# EAGLE design DragonShield (EAGLE 6.2)
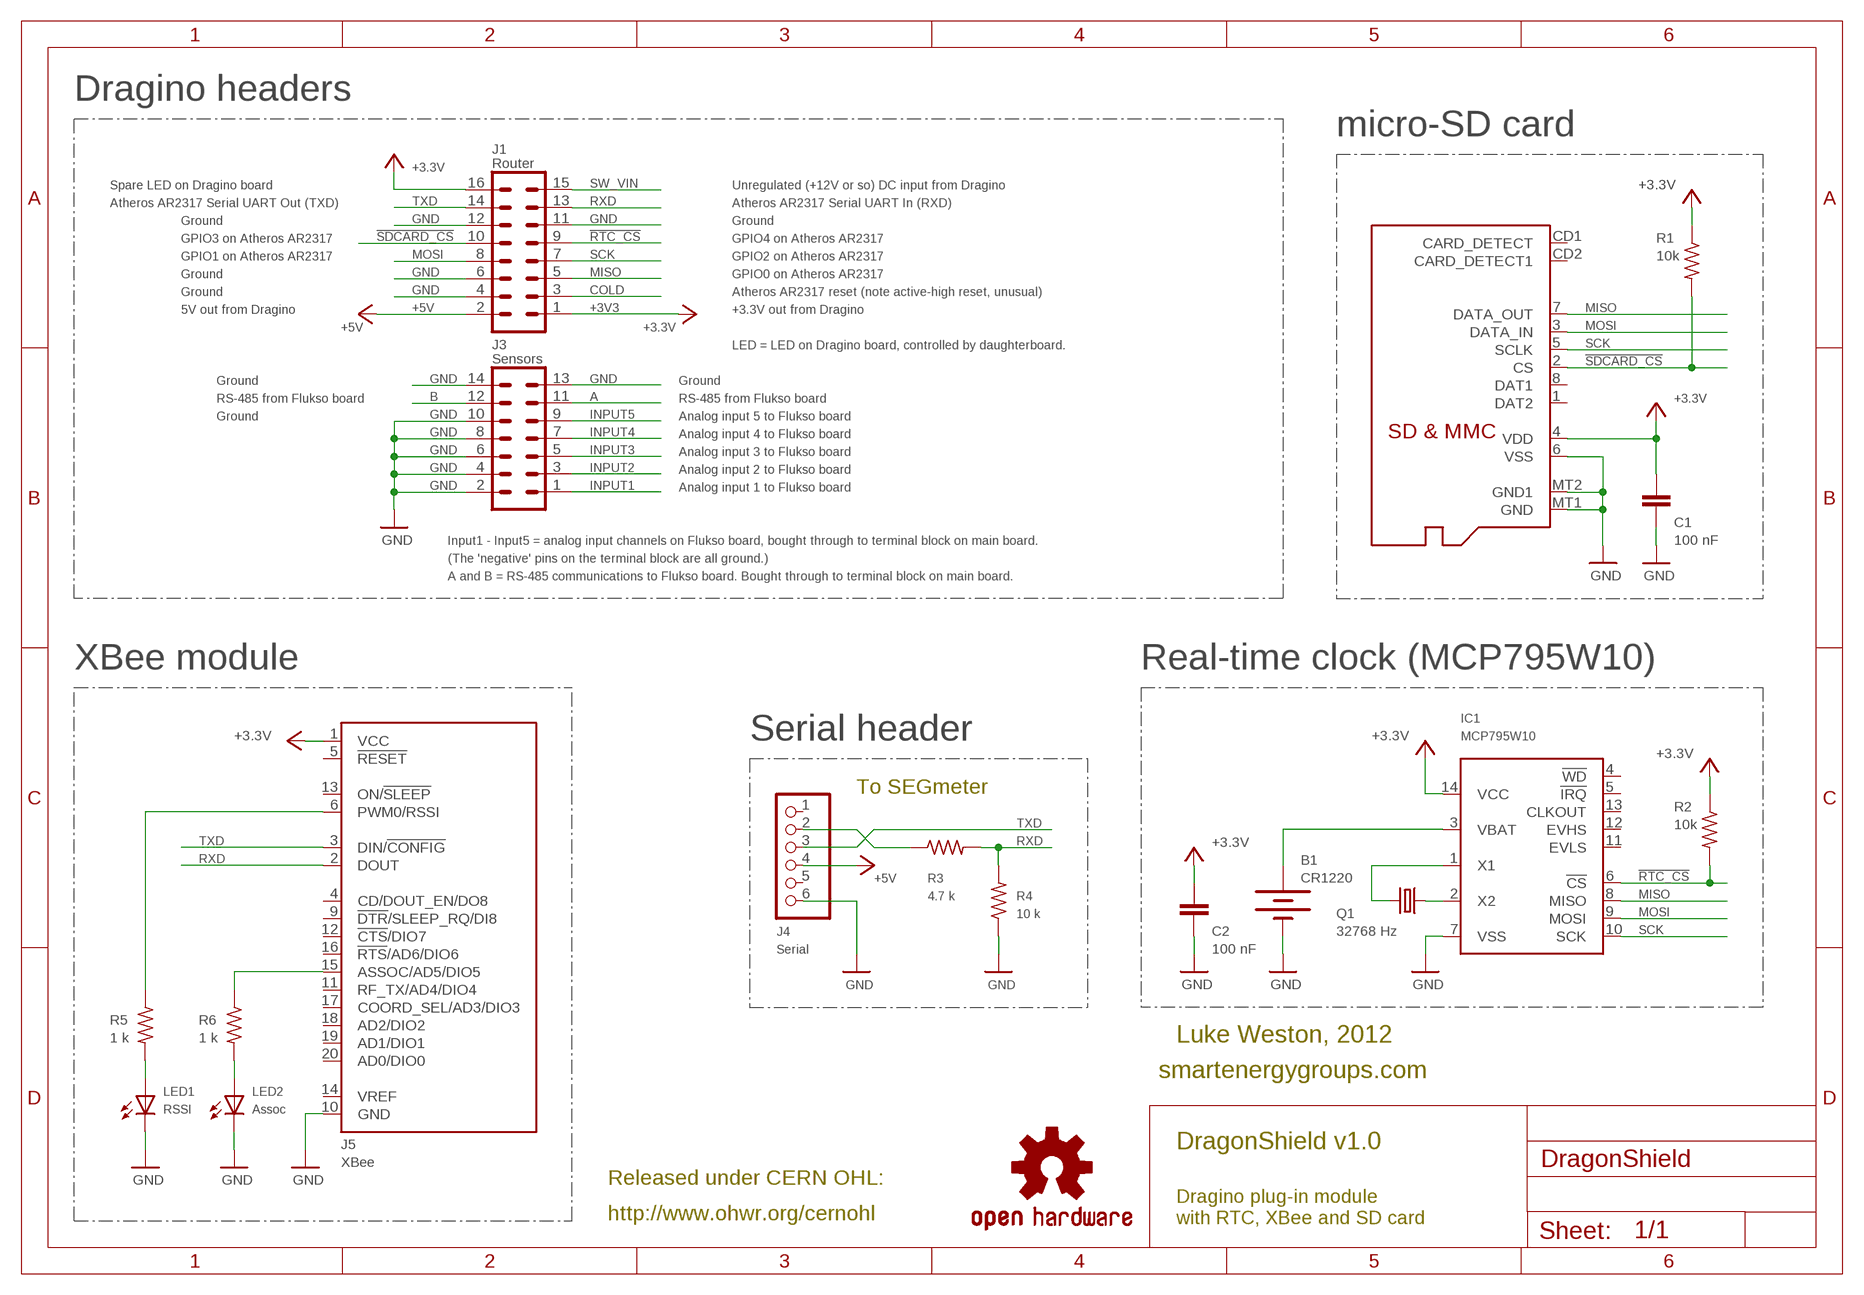
[diagram p0: schematic, sheet 1]

## Parts
B1  CR1220  BATTERY12MM  [BATTCON_12MM]
C1  100 nF  C-EUC0805K  [C0805K]
C2  100 nF  C-EUC0805K  [C0805K]
IC1  MCP795W10  MCP795W10SO  [SOIC14]
J1  Router  MA08-2  [MA08-2]
J2  MICROSD  [MICROSD]
J3  Sensors  MA07-2  [MA07-2]
J4  Serial  PINHD-1X6  [1X06]
J5  XBee  XBEE-PRO  [XBEE-PRO]
LED1  RSSI  LED0805-LARGE  [LED-0805-LARGE]
LED2  Assoc  LED0805-LARGE  [LED-0805-LARGE]
Q1  32768 Hz  CRYSTALTC26H  [TC26H]
R1  10k  R-US_M0805  [M0805]
R2  10k  R-US_M0805  [M0805]
R3  4.7 k  R-US_M0805  [M0805]
R4  10 k  R-US_M0805  [M0805]
R5  1 k  R-US_M0805  [M0805]
R6  1 k  R-US_M0805  [M0805]
U$  OSHW-LOGOS  [OSHW-LOGO-S]

## Nets
!RTC_CS: IC1.6(!CS) J1.9 R2.2
!SDCARD_CS: J1.10 J2.2(CS) R1.2
+3V3: C1.2 C2.2 IC1.14(VCC) J1.1 J1.16 J2.4(VDD) J5.1(VCC) R1.1 R2.1 ; supply symbol labelled +3.3V
+5V: J1.2 J4.4
A: J3.11
B: J3.12
COLD: J1.3
GND: B1.GND(-) C1.1 C2.1 IC1.7(VSS) J1.4 J1.6 J1.11 J1.12 J2.6(VSS) J2.MT1(GND) J2.MT2(GND1) J3.2 J3.4 J3.6 J3.8 J3.10 J3.13 J3.14 J4.6 J5.10(GND) LED1.C LED2.C R4.1
INPUT1: J3.1
INPUT2: J3.3
INPUT3: J3.5
INPUT4: J3.7
INPUT5: J3.9
MISO: IC1.8(MISO) J1.5 J2.7(DATA_OUT)
MOSI: IC1.9(MOSI) J1.8 J2.3(DATA_IN)
N$1: J4.2 R3.1
N$3: IC1.1(X1) Q1.2
N$4: IC1.2(X2) Q1.1
N$5: LED2.A R6.2
N$6: J5.15(ASSOC/AD5/DIO5) R6.1
N$7: LED1.A R5.2
N$8: J5.6(PWM0/RSSI) R5.1
N$11: B1.PWR@1(+) IC1.3(VBAT)
RXD: J1.13 J5.2(DOUT) R3.2 R4.2
SCK: IC1.10(SCK) J1.7 J2.5(SCLK)
SW_VIN: J1.15
TXD: J1.14 J4.3 J5.3(DIN/!CONFIG)
Unconnected: IC1.4(!WD) IC1.5(!IRQ) IC1.11(EVLS) IC1.12(EVHS) IC1.13(CLKOUT) J2.1(DAT2) J2.8(DAT1) J2.CD1(CARD_DETECT) J2.CD2(CARD_DETECT1) J4.1 J4.5 J5.4(CD/DOUT_EN/DO8) J5.5(!RESET) J5.9(!DTR!/SLEEP_RQ/DI8) J5.11(RF_TX/AD4/DIO4) J5.12(!CTS!/DIO7) J5.13(ON/!SLEEP) J5.14(VREF) J5.16(!RTS!/AD6/DIO6) J5.17(COORD_SEL/AD3/DIO3) J5.18(AD2/DIO2) J5.19(AD1/DIO1) J5.20(AD0/DIO0)

## Notes on the sheet
- Dragino headers
- micro-SD card
- Spare LED on Dragino board | Unregulated (+12V or so) DC input from Dragino
- Atheros AR2317 Serial UART Out (TXD) | Atheros AR2317 Serial UART In (RXD)
- Ground | Ground
- GPIO3 on Atheros AR2317 | GPIO4 on Atheros AR2317
- GPIO1 on Atheros AR2317 | GPIO2 on Atheros AR2317
- Ground | GPIO0 on Atheros AR2317
- Ground | Atheros AR2317 reset (note active-high reset, unusual)
- 5V out from Dragino | +3.3V out from Dragino
- LED = LED on Dragino board, controlled by daughterboard.
- Ground | Ground
- RS-485 from Flukso board | RS-485 from Flukso board
- Ground | Analog input 5 to Flukso board
- Analog input 4 to Flukso board
- Analog input 3 to Flukso board
- Analog input 2 to Flukso board
- Analog input 1 to Flukso board
- Input1 - Input5 = analog input channels on Flukso board, bought through to terminal block on main board.
- (The 'negative' pins on the terminal block are all ground.)
- A and B = RS-485 communications to Flukso board. Bought through to terminal block on main board.
- XBee module | Real-time clock (MCP795W10)
- Serial header
- To SEGmeter
- Luke Weston, 2012
- smartenergygroups.com
- DragonShield v1.0
- Released under CERN OHL:
- Dragino plug-in module
- http://www.ohwr.org/cernohl | with RTC, XBee and SD card

## Library data of the parts
B1 = SparkFun:BATTERY: Battery Holders Various common sizes : AA, AAA, 20mm coin cell and 12mm coin cell.
C1 C2 = resistor:C-EU: CAPACITOR, European symbol
IC1 = Luke:MCP795W10
J1 = con-lstb:MA08-2: PIN HEADER; OC_FARNELL: unknown; OC_NEWARK: unknown
J2 = adafruit:MICROSD: Micro-SD / Transflash card holder with SPI pinout For the 3M # 2908-05WB-MG and/or 4UCON #19656 push-push type
J3 = con-lstb:MA07-2: PIN HEADER; OC_FARNELL: unknown; OC_NEWARK: unknown
J4 = pinhead:PINHD-1X6: PIN HEADER
J5 = maxstream:XBEE: XBee (TM) /XBee-PRO(TM) OEM RF Modules Source: MaxStream, Inc. xbee_productmanual.pdf; MPN: XBP24-AWI-001; OC_FARNELL: 1337916; OC_NEWARK: 42M2667
LED1 LED2 = freetronics:LED: LEDs Standard schematic elements and footprints for 5mm, 3mm, 1206, and 0603 sized LEDs. 5mm - Spark Fun Electronics SKU : COM-00529 (and others)
Q1 = SparkFun:CRYSTAL: Crystals Various standard crystals. Proven footprints. Spark Fun Electronics SKU : COM-00534
R1-R6 = resistor:R-US_: RESISTOR, American symbol
U$ = SparkFun:OSHW-LOGO: Open Source Hardware Logo This logo indicates the piece of hardware it is found on incorporates a OSHW license and/or adheres to the definition of open source hardware found here: http://freedomdefined.org/OSHW

## Board
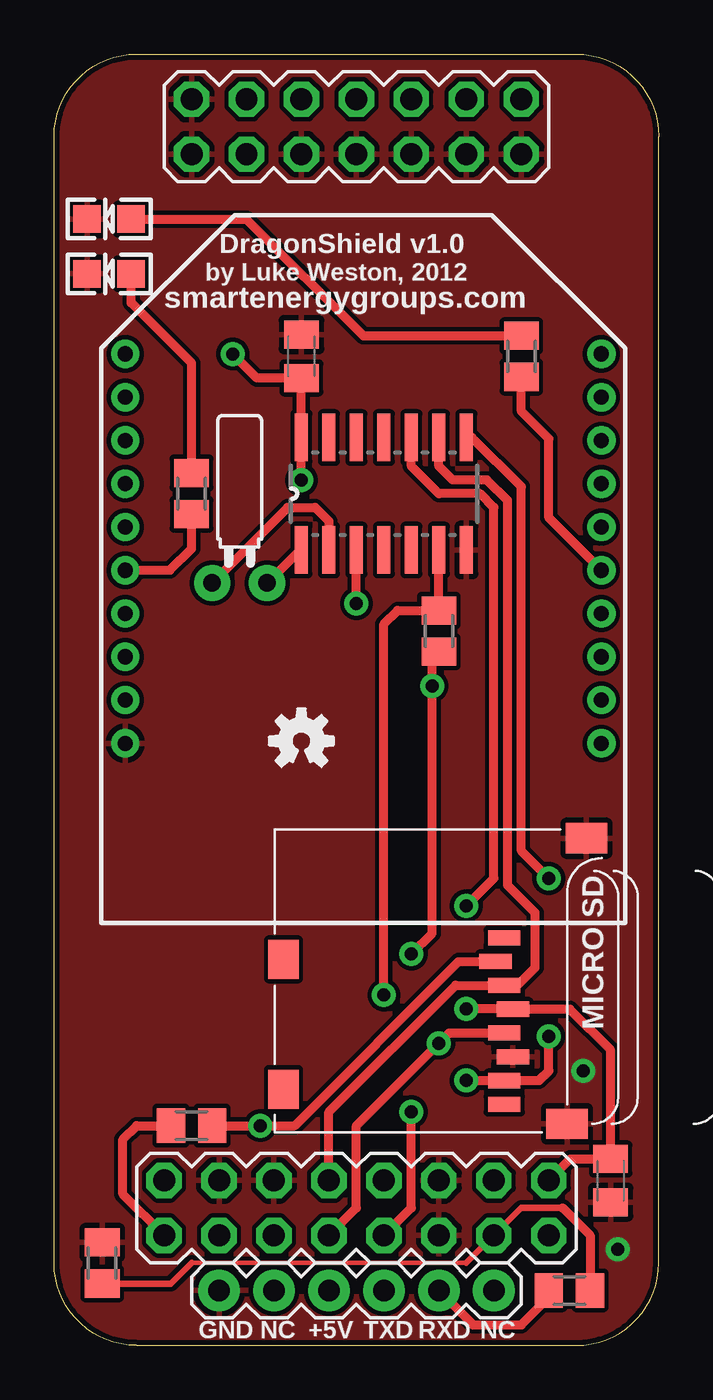
[diagram p1: board, top side]
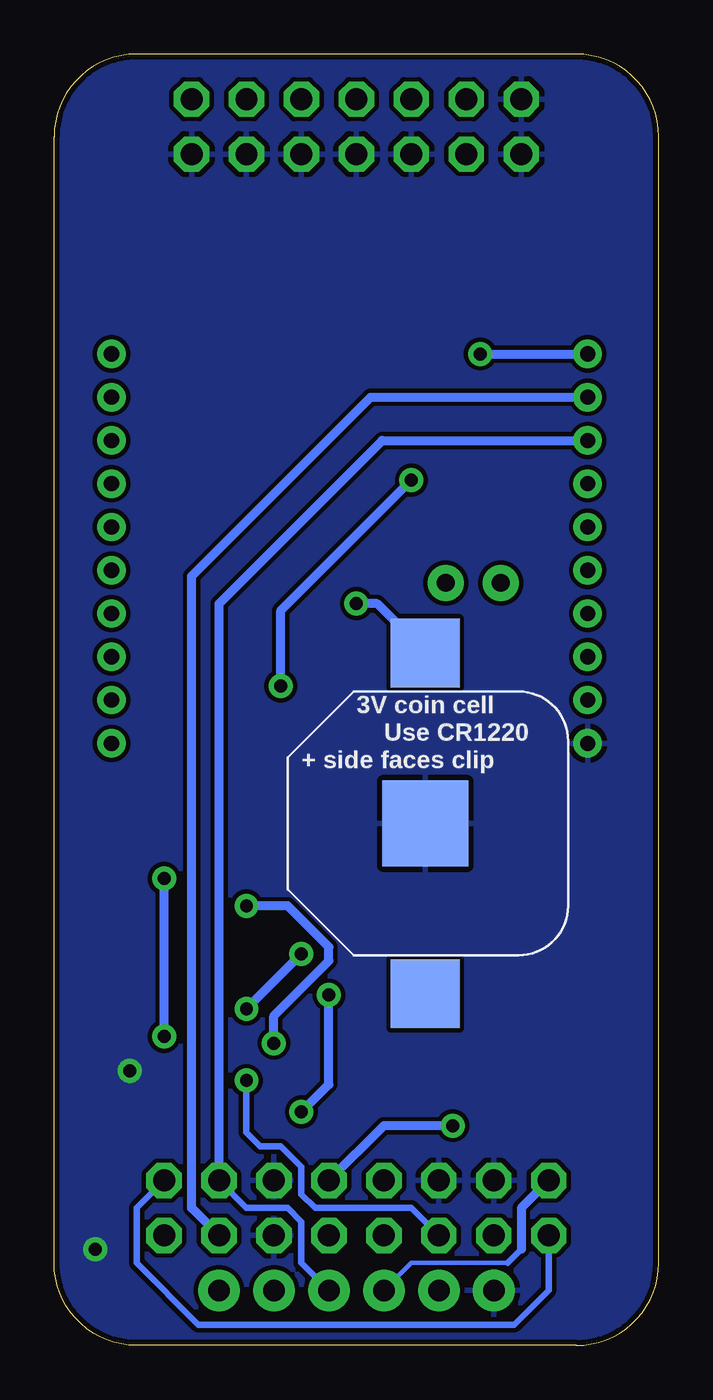
[diagram p2: board, bottom side, seen from below]

Size 27.94 x 59.69 mm. Coordinates in mm from the lower left corner, seen from the top.
Outline: 27.94,3.81 27.94,55.88 arc90 24.13,59.69 3.81,59.69 arc90 0,55.88 0,3.81 arc90 3.81,0 24.13,0 arc90 27.94,3.81
Copper layers (1*16): Top 0.035mm / dielectric 1.5mm / Bottom 0.035mm
Design rules: minimum track width 8mil, minimum drill 20mil, track to track 8mil, track to pad 8mil, pad to pad 8mil, via to via 8mil, smd to smd 8mil, copper to edge 10mil, drill to drill 8mil, minimum pad ring 12mil, minimum via ring 10mil, stop-mask expansion 4mil, vias tented up to drill 25mil, thermal gap 10mil

### Footprints (pad centres in the part's own frame; a part is rotated, then mirrored left to right if it is on the bottom)
BATTCON_12MM = smd 3.962 x 3.962: GND 0,0 | smd 3.175 x 3.175: PWR@1 -7.874,0; PWR@2 7.874,0
C0805K = smd 1.3 x 1.6: 1 -1,0; 2 1,0
SOIC14 = smd 0.6 x 2.2: 1 -3.81,-2.6; 2 -2.54,-2.6; 3 -1.27,-2.6; 4 0,-2.6; 5 1.27,-2.6; 6 2.54,-2.6; 7 3.81,-2.6; 8 3.81,2.6; 9 2.54,2.6; 10 1.27,2.6; 11 0,2.6; 12 -1.27,2.6; 13 -2.54,2.6; 14 -3.81,2.6
MA08-2 = drill 1.016 octagon: 1 -8.89,-1.27; 2 -8.89,1.27; 3 -6.35,-1.27; 4 -6.35,1.27; 5 -3.81,-1.27; 6 -3.81,1.27; 7 -1.27,-1.27; 8 -1.27,1.27; 9 1.27,-1.27; 10 1.27,1.27; 11 3.81,-1.27; 12 3.81,1.27; 13 6.35,-1.27; 14 6.35,1.27; 15 8.89,-1.27; 16 8.89,1.27
MICROSD = smd 0.7 x 1.5: 1 9,-10.64; 2 7.9,-10.24; 3 6.8,-10.64; 4 5.7,-11.04; 5 4.6,-10.64; 6 3.5,-11.04; 7 2.4,-10.64; 8 1.3,-10.64 | smd 1.8 x 1.4: CD1 2,-0.44; CD2 8,-0.44 | smd 1.4 x 1.9: MT1 0.4,-13.54; MT2 13.6,-14.44
MA07-2 = drill 1.016 octagon: 1 -7.62,-1.27; 2 -7.62,1.27; 3 -5.08,-1.27; 4 -5.08,1.27; 5 -2.54,-1.27; 6 -2.54,1.27; 7 0,-1.27; 8 0,1.27; 9 2.54,-1.27; 10 2.54,1.27; 11 5.08,-1.27; 12 5.08,1.27; 13 7.62,-1.27; 14 7.62,1.27
1X06 = drill 1 pad 1.93: 1 -6.35,0; 2 -3.81,0; 3 -1.27,0; 4 1.27,0; 5 3.81,0; 6 6.35,0
XBEE-PRO = drill 0.7 pad 1.27: 1 -11,9; 2 -11,7; 3 -11,5; 4 -11,3; 5 -11,1; 6 -11,-1; 7 -11,-3; 8 -11,-5; 9 -11,-7; 10 -11,-9; 11 11,-9; 12 11,-7; 13 11,-5; 14 11,-3; 15 11,-1; 16 11,1; 17 11,3; 18 11,5; 19 11,7; 20 11,9
LED-0805-LARGE = smd 1.27 x 1.27: A -1.016,0; C 1.016,0
TC26H = drill 0.813 pad 1.676: 1 -1.27,0; 2 1.27,0
M0805 = smd 1.3 x 1.6: 1 -0.95,0; 2 0.95,0

### Placement (x,y rotation side)
B1  10.79,24.13 270 bottom
C1  25.72,7.62 90 top
C2  11.43,45.72 270 top
IC1  15.24,39.37 0 top
J1  13.97,6.35 0 top
J2  10.16,9.84 90 top
J3  13.97,56.34 180 top
J4  13.97,2.54 180 top
J5  14.29,36.83 0 top
LED1  2.54,49.53 180 top
LED2  2.54,52.07 180 top
Q1  8.57,35.24 0 top
R1  6.35,10.16 0 top
R2  17.78,33.02 90 top
R3  23.81,2.54 0 top
R4  2.22,3.81 270 top
R5  6.35,39.37 90 top
R6  21.59,45.72 90 top
U$  11.43,27.94 0 top

### Tracks (layer width: path | path; a pad name or v marks a point on that pad's centre or on a via)
!RTC_CS  (via drill 0.6)
  Top 0.406: IC1.6 R2.2 15.87,33.97 15.24,33.34 v15.24,16.19 | J1.9 16.51,6.35 v16.51,10.79
  Bottom 0.406: v16.51,10.79 15.24,12.07 v15.24,16.19
!SDCARD_CS  (via drill 0.6)
  Top 0.406: R1.2 v9.53,10.16 11.11,10.16 18.7,17.74 J2.2
  Bottom 0.406: v9.53,10.16 12.7,10.16 J1.10
+3V3  (via drill 0.6)
  Top 0.305: 17.46,31.75 R2.1
  Top 0.406: R1.1 3.81,10.16 3.18,9.53 3.18,6.99 J1.1 | v11.43,40 IC1.14 C2.2 9.37,44.72 v8.26,45.83 | v16.51,18.1 17.46,19.05 v17.46,30.48 17.46,31.75 | J1.16 23.86,8.62 C1.2 25.72,13.65 23.83,15.54 J2.4 21.18,15.56 v19.05,15.56
  Bottom 0.305: J1.1 5.08,2.54 6.67,0.95 21.27,0.95 24.13,3.81 24.13,6.35 J1.16
  Bottom 0.406: v11.43,40 17.46,33.97 v17.46,30.48 | v19.05,15.56 v16.51,18.1 | v8.26,45.83 J5.1
+5V
  Bottom 0.203: J4.4 11.43,3.81 6.99,3.81
  Bottom 0.305: 6.35,4.45 6.99,3.81
  Bottom 0.406: 6.35,4.45 6.35,6.35 J1.2
GND  (via drill 0.6)
  other vias: 26.04,4.45 24.45,12.7
  pour Bottom: -1.27,60.96 29.21,60.96 29.21,-1.27 -1.27,-1.27
  pour Top: -1.27,60.96 29.21,60.96 29.21,-1.27 -1.27,-1.27
MISO  (via drill 0.6)
  Top 0.305: 19.31,41.97 IC1.8
  Top 0.406: 19.31,41.97 21.59,39.69 21.59,22.86 v22.86,21.59 | v22.86,14.29 22.86,12.7 22.4,12.24 J2.7 v19.05,12.24
  Bottom 0.305: J1.5 11.43,6.35 15.88,6.35 16.51,6.99 16.51,8.26 17.46,9.21 18.41,9.21 19.05,9.84 v19.05,12.24
  Bottom 0.406: v22.86,14.29 v22.86,21.59
MOSI
  Top 0.406: J1.8 12.7,10.79 18.55,16.64 J2.3 21.41,16.64 22.23,17.46 22.23,20 20.96,21.27 20.96,39.05 20,40 18.41,40 17.78,40.64 IC1.9
N$1
  Top 0.406: J4.2 19.37,0.95 21.59,0.95 22.54,1.9 R3.1
N$3
  Top 0.406: IC1.1 11.37,36.77 Q1.2
N$4
  Top 0.406: IC1.2 12.7,38.1 12.07,38.73 10.79,38.73 Q1.1
N$5
  Top 0.406: LED2.A 8.89,52.07 14.29,46.67 R6.2
N$6
  Top 0.406: R6.1 21.59,43.18 22.86,41.91 22.86,38.26 J5.15
N$7
  Top 0.406: LED1.A 3.56,48.2 6.35,45.4 R5.2
N$8
  Top 0.406: J5.6 5.35,35.83 6.35,36.83 R5.1
N$11  (via drill 0.6)
  Top 0.406: v13.97,34.29 IC1.3
  Bottom 0.305: B1.PWR@1 10.41,32 | 10.41,32 10.16,31.75 | 10.41,32 10.79,32.07
  Bottom 0.406: 10.79,32.07 13.02,34.29 v13.97,34.29
RXD
  Top 0.203: 6.35,3.81 19.05,3.81
  Top 0.305: 23.5,6.35 21.59,6.35 J1.13 19.05,3.81 | R4.2 5.4,2.86 6.35,3.81
  Top 0.406: 23.5,6.35 24.77,5.08 R3.2
  Bottom 0.406: J1.13 21.59,6.35 21.59,35.56 13.32,43.83 J5.2
SCK  (via drill 0.6)
  Top 0.406: J1.7 13.97,6.35 13.97,10.16 v17.78,13.97 18.25,14.44 J2.5 | IC1.10 16.51,40.64 17.78,39.37 19.68,39.37 20.32,38.73 20.32,21.59 v19.05,20.32
  Bottom 0.406: v19.05,20.32 17.14,20.32 15.24,18.41 15.24,17.78 17.78,15.24 v17.78,13.97
TXD
  Bottom 0.305: J4.3 16.51,3.81 16.51,5.71 17.14,6.35 19.05,6.35 J1.14
  Bottom 0.406: J1.14 20.32,34.29 12.78,41.83 J5.3

### Text on the board
tPlace: DragonShield v1.0 | by Luke Weston, 2012 | smartenergygroups.com | MICRO SD | GND | NC | +5V | TXD | RXD | NC
bPlace: 3V coin cell | Use CR1220 | + side faces clip